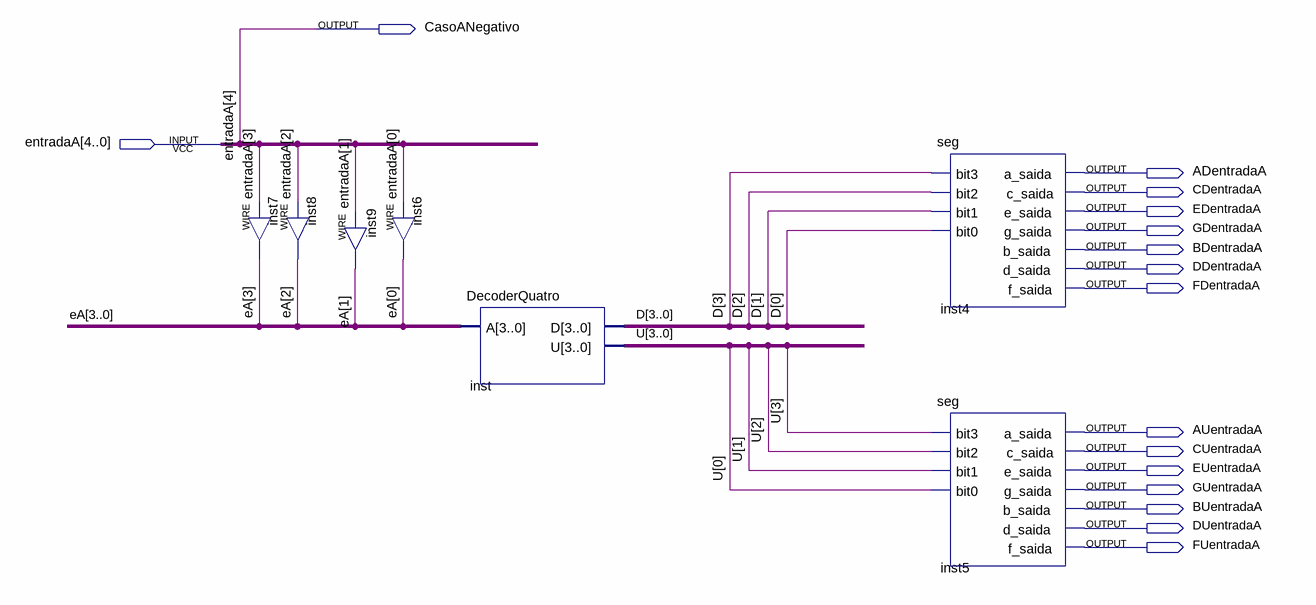
[diagram p0: schematic sheet]
// Quartus schematic EntradaA.bdf as structural Verilog: 7 symbols, 16 pins
module EntradaA (
  input  [4:0] entradaA,
  output CasoANegativo,
  output ADentradaA,
  output CDentradaA,
  output EDentradaA,
  output GDentradaA,
  output BDentradaA,
  output DDentradaA,
  output FDentradaA,
  output AUentradaA,
  output CUentradaA,
  output EUentradaA,
  output GUentradaA,
  output BUentradaA,
  output DUentradaA,
  output FUentradaA
);

  wire [3:0] D, eA, U;

  assign eA[3] = entradaA[3];  // WIRE inst7
  assign eA[2] = entradaA[2];  // WIRE inst8
  assign eA[1] = entradaA[1];  // WIRE inst9
  assign eA[0] = entradaA[0];  // WIRE inst6
  DecoderQuatro inst (.A(eA), .D(D), .U(U));
  seg inst4 (
    .bit3(D[3]), .bit2(D[2]), .bit1(D[1]), .bit0(D[0]), .a_saida(ADentradaA), .c_saida(CDentradaA),
    .e_saida(EDentradaA), .g_saida(GDentradaA), .b_saida(BDentradaA), .d_saida(DDentradaA),
    .f_saida(FDentradaA));
  seg inst5 (
    .bit3(U[3]), .bit2(U[2]), .bit1(U[1]), .bit0(U[0]), .a_saida(AUentradaA), .c_saida(CUentradaA),
    .e_saida(EUentradaA), .g_saida(GUentradaA), .b_saida(BUentradaA), .d_saida(DUentradaA),
    .f_saida(FUentradaA));

  assign CasoANegativo = entradaA[4];
endmodule
